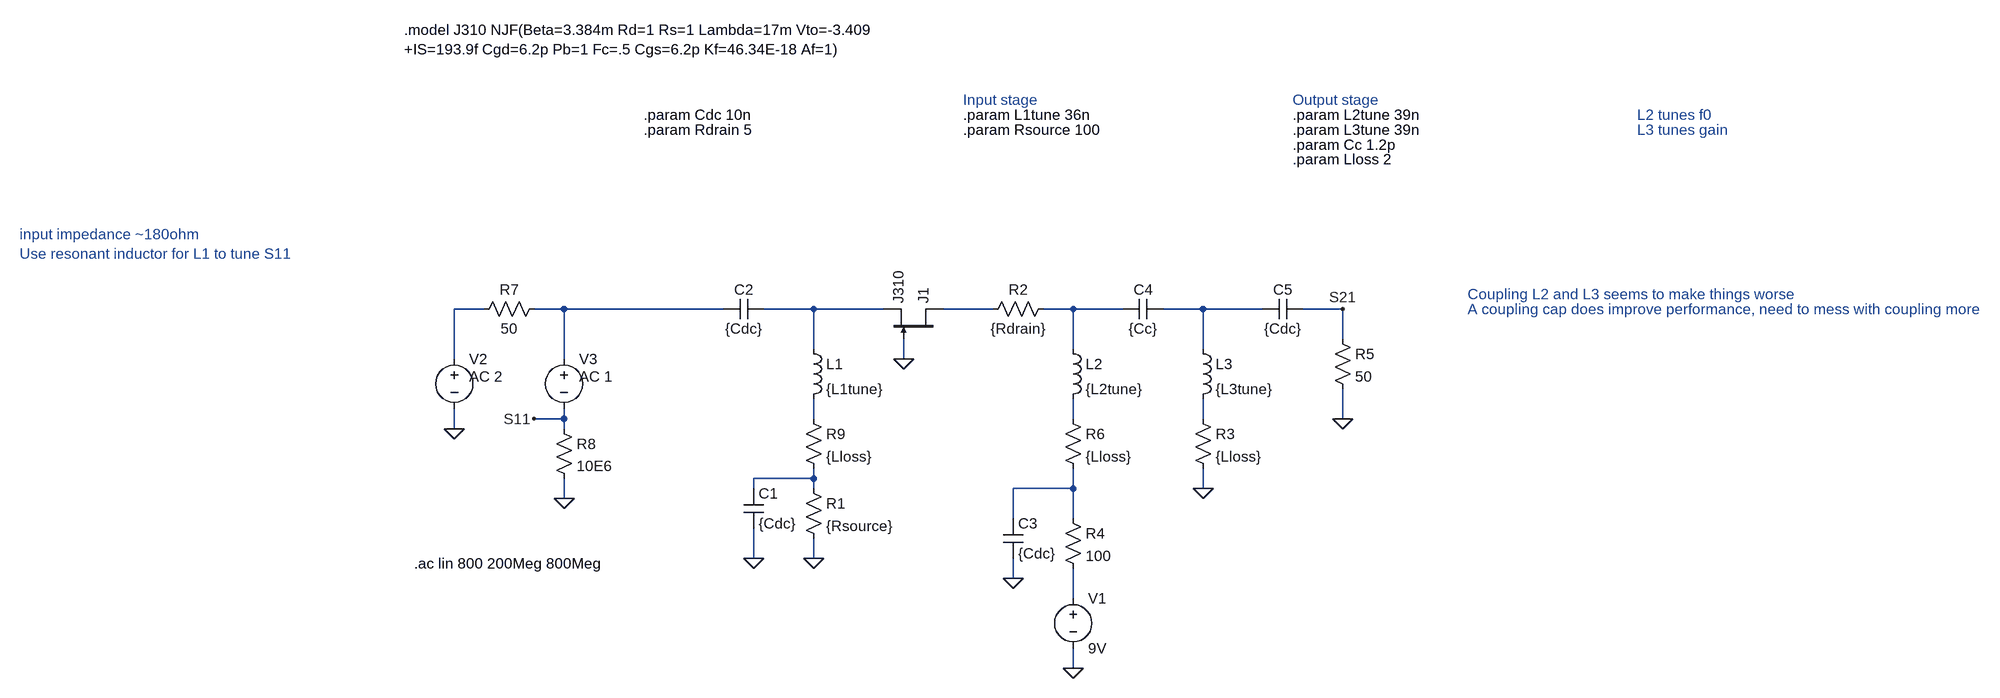
[diagram p0: schematic LNA.asc]
LNA.asc, the LTspice schematic file:
Version 4
SHEET 1 1920 820
WIRE -544 144 -592 144
WIRE -416 144 -464 144
WIRE -160 144 -416 144
WIRE -16 144 -96 144
WIRE 96 144 -16 144
WIRE 272 144 192 144
WIRE 400 144 352 144
WIRE 480 144 400 144
WIRE 608 144 544 144
WIRE 704 144 608 144
WIRE 832 144 768 144
WIRE 832 192 832 144
WIRE -16 208 -16 144
WIRE 400 208 400 144
WIRE 608 208 608 144
WIRE -592 224 -592 144
WIRE -416 224 -416 144
WIRE 128 224 128 192
WIRE -416 320 -416 304
WIRE -416 320 -464 320
WIRE -16 320 -16 288
WIRE 400 320 400 288
WIRE 608 320 608 288
WIRE 832 320 832 272
WIRE -592 336 -592 304
WIRE -416 336 -416 320
WIRE -16 416 -16 400
WIRE -16 416 -112 416
WIRE -112 432 -112 416
WIRE -16 432 -16 416
WIRE 400 432 400 400
WIRE 400 432 304 432
WIRE 608 432 608 400
WIRE -416 448 -416 416
WIRE 304 480 304 432
WIRE 400 480 400 432
WIRE -112 544 -112 496
WIRE -16 544 -16 512
WIRE 304 576 304 544
WIRE 400 608 400 560
WIRE 400 720 400 688
FLAG -16 544 0
FLAG -112 544 0
FLAG 128 224 0
FLAG 400 720 0
FLAG 304 576 0
FLAG -592 336 0
FLAG -416 448 0
FLAG -464 320 S11
FLAG 832 144 S21
FLAG 832 320 0
FLAG 608 432 0
SYMBOL njf 192 192 M270
SYMATTR InstName J1
SYMATTR Value J310
SYMBOL ind -32 192 R0
SYMATTR InstName L1
SYMATTR Value {L1tune}
SYMBOL cap -128 432 R0
SYMATTR InstName C1
SYMATTR Value {Cdc}
SYMBOL res -32 416 R0
SYMATTR InstName R1
SYMATTR Value {Rsource}
SYMBOL cap -96 128 R90
WINDOW 0 0 32 VBottom 2
WINDOW 3 32 32 VTop 2
SYMATTR InstName C2
SYMATTR Value {Cdc}
SYMBOL res 368 128 R90
WINDOW 0 0 56 VBottom 2
WINDOW 3 32 56 VTop 2
SYMATTR InstName R2
SYMATTR Value {Rdrain}
SYMBOL res 384 464 R0
SYMATTR InstName R4
SYMATTR Value 100
SYMBOL cap 288 480 R0
SYMATTR InstName C3
SYMATTR Value {Cdc}
SYMBOL voltage 400 592 R0
SYMATTR InstName V1
SYMATTR Value 9V
SYMBOL voltage -592 208 R0
WINDOW 123 24 44 Left 2
WINDOW 39 0 0 Left 0
SYMATTR Value2 AC 2
SYMATTR InstName V2
SYMATTR Value ""
SYMBOL voltage -416 208 R0
WINDOW 123 24 44 Left 2
WINDOW 39 0 0 Left 0
SYMATTR Value2 AC 1
SYMATTR InstName V3
SYMATTR Value ""
SYMBOL res -448 128 R90
WINDOW 0 0 56 VBottom 2
WINDOW 3 32 56 VTop 2
SYMATTR InstName R7
SYMATTR Value 50
SYMBOL res -432 320 R0
SYMATTR InstName R8
SYMATTR Value 10E6
SYMBOL res 816 176 R0
SYMATTR InstName R5
SYMATTR Value 50
SYMBOL cap 544 128 R90
WINDOW 0 0 32 VBottom 2
WINDOW 3 32 32 VTop 2
SYMATTR InstName C4
SYMATTR Value {Cc}
SYMBOL res 592 304 R0
SYMATTR InstName R3
SYMATTR Value {Lloss}
SYMBOL res 384 304 R0
SYMATTR InstName R6
SYMATTR Value {Lloss}
SYMBOL ind 384 192 R0
SYMATTR InstName L2
SYMATTR Value {L2tune}
SYMBOL ind 592 192 R0
SYMATTR InstName L3
SYMATTR Value {L3tune}
SYMBOL res -32 304 R0
SYMATTR InstName R9
SYMATTR Value {Lloss}
SYMBOL cap 768 128 R90
WINDOW 0 0 32 VBottom 2
WINDOW 3 32 32 VTop 2
SYMATTR InstName C5
SYMATTR Value {Cdc}
TEXT 752 -168 Left 2 !.param L2tune 39n
TEXT 752 -144 Left 2 !.param L3tune 39n
TEXT 752 -192 Left 2 ;Output stage
TEXT 752 -120 Left 2 !.param Cc 1.2p
TEXT 752 -96 Left 2 !.param Lloss 2
TEXT 224 -144 Left 2 !.param Rsource 100
TEXT -656 552 Left 2 !.ac lin 800 200Meg 800Meg
TEXT -672 -304 Left 2 !.model J310 NJF(Beta=3.384m Rd=1 Rs=1 Lambda=17m Vto=-3.409\n+IS=193.9f Cgd=6.2p Pb=1 Fc=.5 Cgs=6.2p Kf=46.34E-18 Af=1)
TEXT 224 -168 Left 2 !.param L1tune 36n
TEXT -1288 24 Left 2 ;input impedance ~180ohm\nUse resonant inductor for L1 to tune S11
TEXT 224 -192 Left 2 ;Input stage
TEXT 1032 120 Left 2 ;Coupling L2 and L3 seems to make things worse
TEXT 1032 144 Left 2 ;A coupling cap does improve performance, need to mess with coupling more
TEXT 1304 -168 Left 2 ;L2 tunes f0
TEXT 1304 -144 Left 2 ;L3 tunes gain
TEXT -288 -144 Left 2 !.param Rdrain 5
TEXT -288 -168 Left 2 !.param Cdc 10n

The netlist it stands for:
* LNA.asc
J1 N004 0 N003 J310
L1 N003 N007 {L1tune}
C1 N010 0 {Cdc}
R1 N010 0 {Rsource}
C2 N003 N002 {Cdc}
R2 N005 N004 {Rdrain}
R4 N011 N012 100
C3 N011 0 {Cdc}
V1 N012 0 9V
V2 N001 0 AC 2
V3 N002 S11 AC 1
R7 N002 N001 50
R8 S11 0 10E6
R5 S21 0 50
C4 N006 N005 {Cc}
R3 N009 0 {Lloss}
R6 N008 N011 {Lloss}
L2 N005 N008 {L2tune}
L3 N006 N009 {L3tune}
R9 N007 N010 {Lloss}
C5 S21 N006 {Cdc}
.model NJF NJF
.model PJF PJF
.lib standard.jft
.param L2tune 39n
.param L3tune 39n
* Output stage
.param Cc 1.2p
.param Lloss 2
.param Rsource 100
.ac lin 800 200Meg 800Meg
.model J310 NJF(Beta=3.384m Rd=1 Rs=1 Lambda=17m Vto=-3.409
+IS=193.9f Cgd=6.2p Pb=1 Fc=.5 Cgs=6.2p Kf=46.34E-18 Af=1)
.param L1tune 36n
* input impedance ~180ohm
* Use resonant inductor for L1 to tune S11
* Input stage
* Coupling L2 and L3 seems to make things worse
* A coupling cap does improve performance, need to mess with coupling more
* L2 tunes f0
* L3 tunes gain
.param Rdrain 5
.param Cdc 10n
.backanno
.end